# Altium project PCB_F2838_Node.PrjPcb (part 4 of 5)

## Sheet [6] ETHERCAT.SchDoc
size 431 x 279 mm; DocumentNumber: 7; SheetNumber: 7; SheetTotal: 9
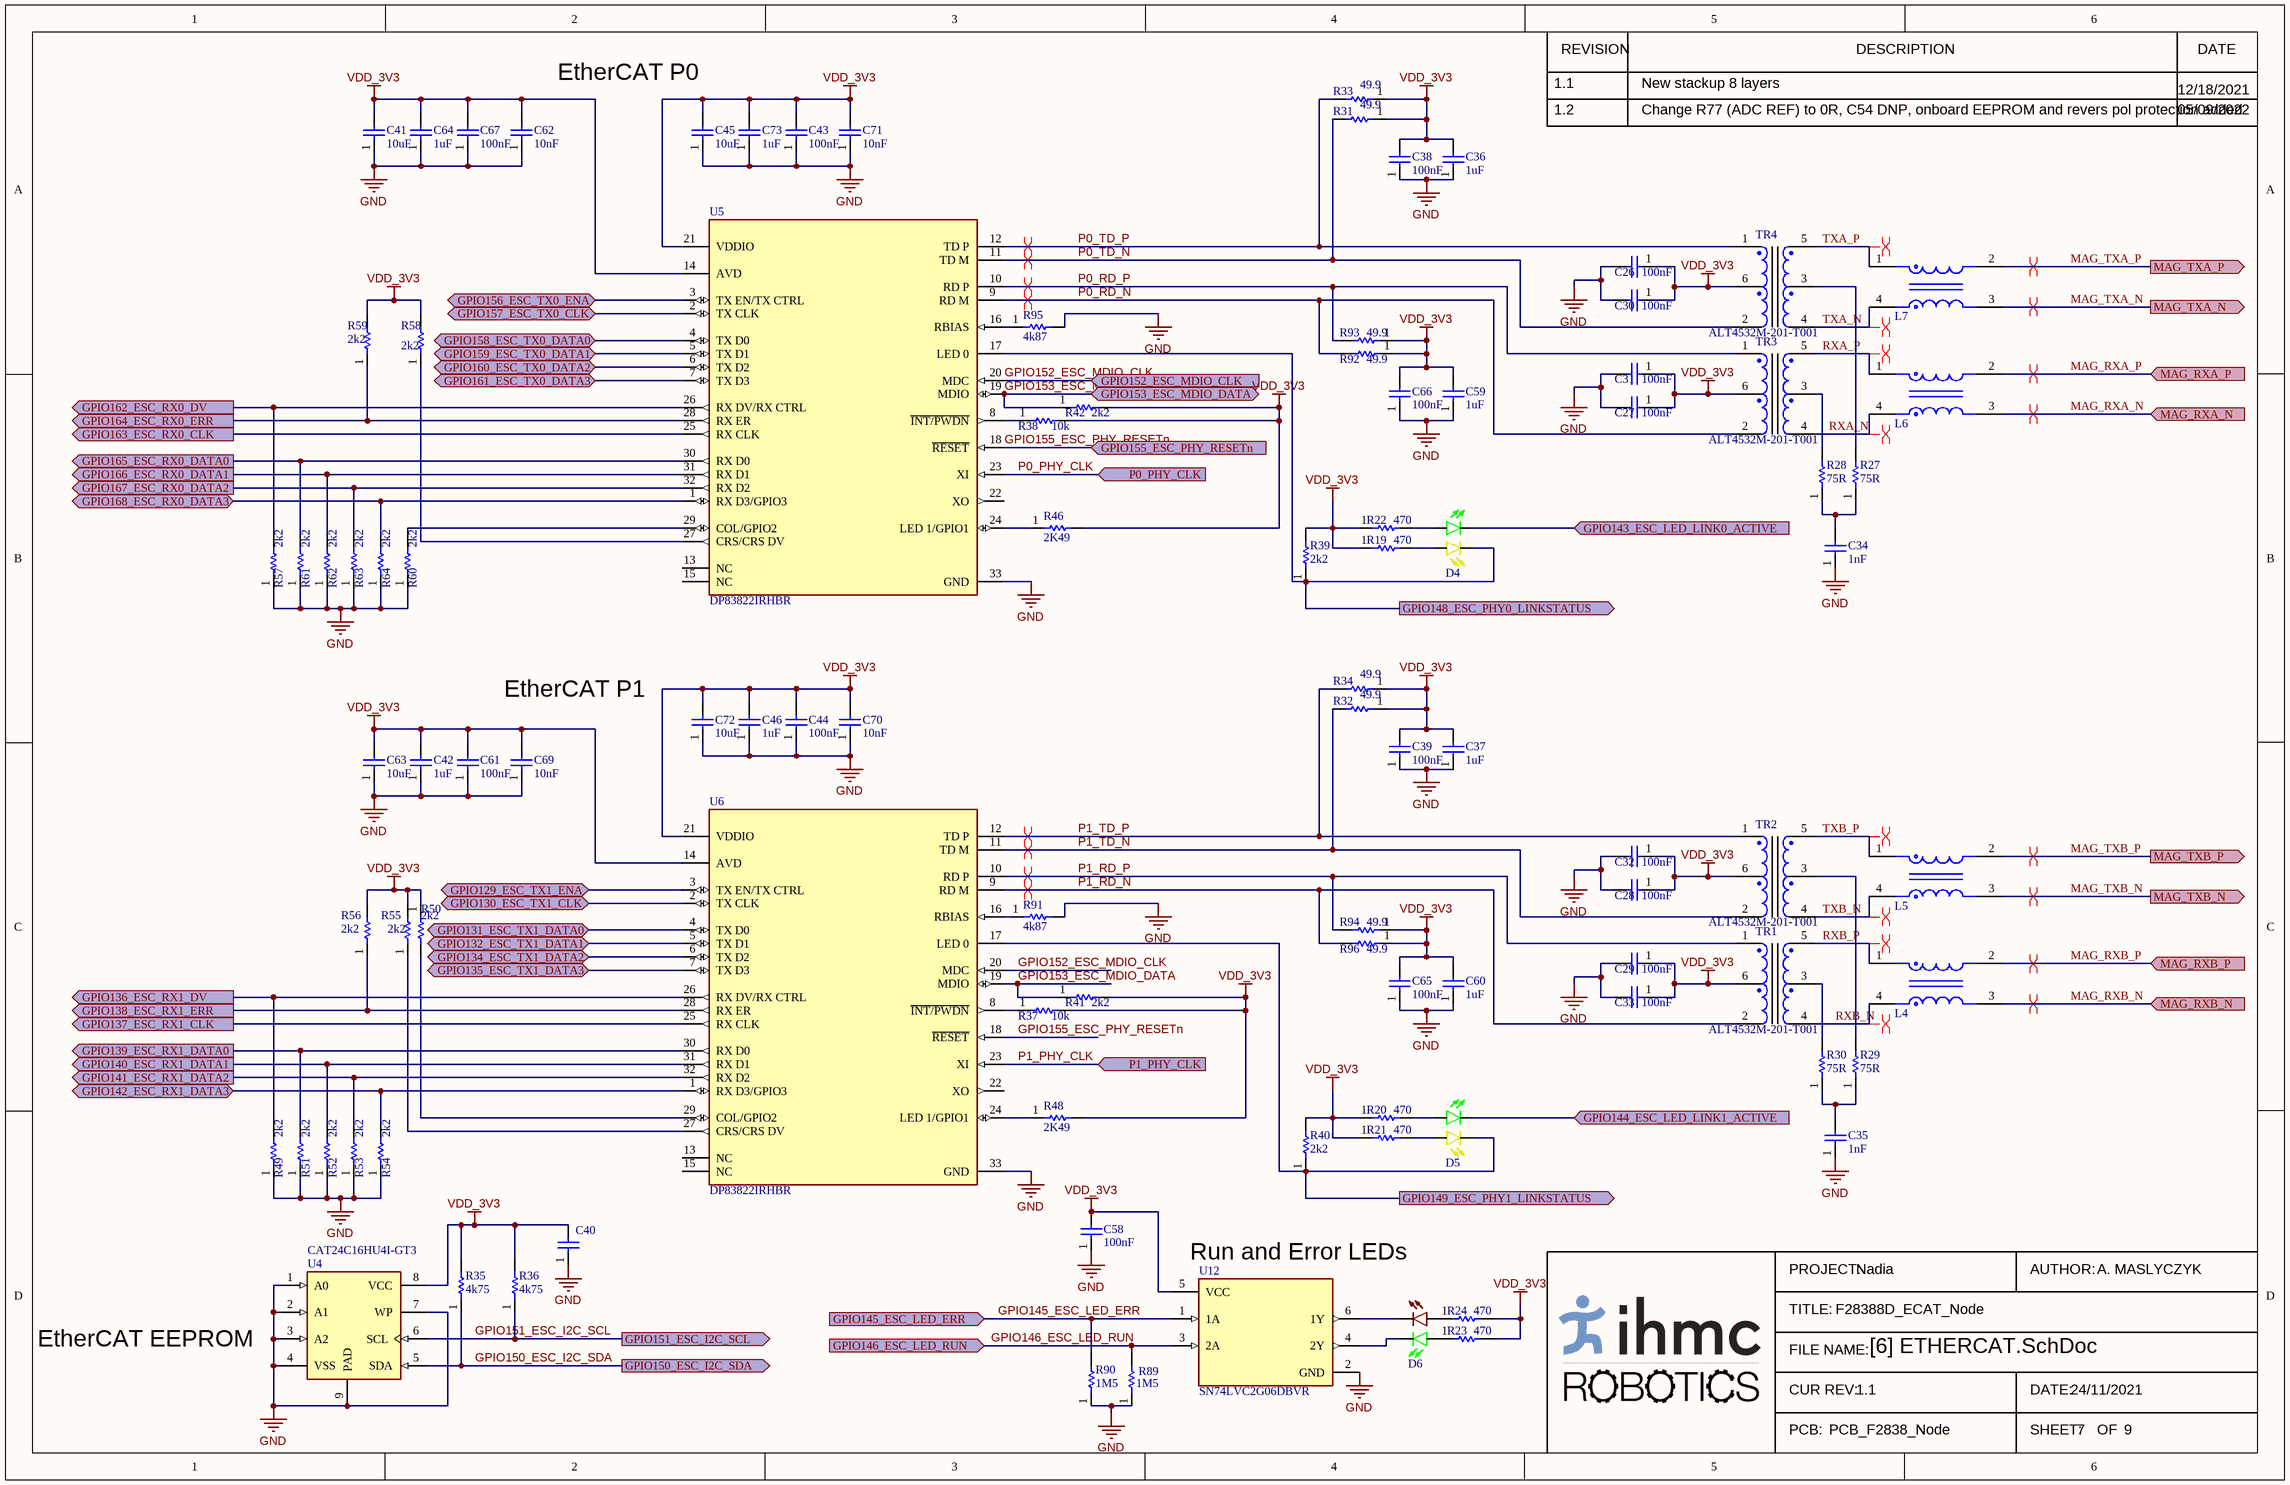
[diagram p6: [6] ETHERCAT.SchDoc]

### Parts
C26  value 100nF  [CAPC1005X03N(0402)]  (hidden comment: GRM155R71C104JA88D)
C27  value 100nF  [CAPC1005X03N(0402)]  (hidden comment: GRM155R71C104JA88D)
C28  value 100nF  [CAPC1005X03N(0402)]  (hidden comment: GRM155R71C104JA88D)
C29  value 100nF  [CAPC1005X03N(0402)]  (hidden comment: GRM155R71C104JA88D)
C30  value 100nF  [CAPC1005X03N(0402)]  (hidden comment: GRM155R71C104JA88D)
C31  value 100nF  [CAPC1005X03N(0402)]  (hidden comment: GRM155R71C104JA88D)
C32  value 100nF  [CAPC1005X03N(0402)]  (hidden comment: GRM155R71C104JA88D)
C33  value 100nF  [CAPC1005X03N(0402)]  (hidden comment: GRM155R71C104JA88D)
C34  value 1nF  [0402_C]  (hidden comment: C1005NP01H102J050BA)
C35  value 1nF  [0402_C]  (hidden comment: C1005NP01H102J050BA)
C36  value 1uF  [CAPC1608X09N(0603)]  (hidden comment: C0603C105K3PACTU)
C37  value 1uF  [CAPC1608X09N(0603)]  (hidden comment: C0603C105K3PACTU)
C38  value 100nF  [CAPC1005X03N(0402)]  (hidden comment: GRM155R71C104JA88D)
C39  value 100nF  [CAPC1005X03N(0402)]  (hidden comment: GRM155R71C104JA88D)
C40  GRM155R71C104JA88D  [CAPC1005X03N(0402)]  (value not drawn)
C41  value 10uF  [CAPC1608X09N(0603)]  (hidden comment: CL10X106MO8NRNC)
C42  value 1uF  [CAPC1608X09N(0603)]  (hidden comment: C0603C105K3PACTU)
C43  value 100nF  [CAPC1005X03N(0402)]  (hidden comment: GRM155R71C104JA88D)
C44  value 100nF  [CAPC1005X03N(0402)]  (hidden comment: GRM155R71C104JA88D)
C45  value 10uF  [CAPC1608X09N(0603)]  (hidden comment: CL10X106MO8NRNC)
C46  value 1uF  [CAPC1608X09N(0603)]  (hidden comment: C0603C105K3PACTU)
C58  value 100nF  [CAPC1005X03N(0402)]  (hidden comment: GRM155R71C104JA88D)
C59  value 1uF  [CAPC1608X09N(0603)]  (hidden comment: C0603C105K3PACTU)
C60  value 1uF  [CAPC1608X09N(0603)]  (hidden comment: C0603C105K3PACTU)
C61  value 100nF  [CAPC1005X03N(0402)]  (hidden comment: GRM155R71C104JA88D)
C62  value 10nF  [CAPC1005X03N(0402)]  (hidden comment: CC0402KRX7R9BB103)
C63  value 10uF  [CAPC1608X09N(0603)]  (hidden comment: CL10X106MO8NRNC)
C64  value 1uF  [CAPC1608X09N(0603)]  (hidden comment: C0603C105K3PACTU)
C65  value 100nF  [CAPC1005X03N(0402)]  (hidden comment: GRM155R71C104JA88D)
C66  value 100nF  [CAPC1005X03N(0402)]  (hidden comment: GRM155R71C104JA88D)
C67  value 100nF  [CAPC1005X03N(0402)]  (hidden comment: GRM155R71C104JA88D)
C69  value 10nF  [CAPC1005X03N(0402)]  (hidden comment: CC0402KRX7R9BB103)
C70  value 10nF  [CAPC1005X03N(0402)]  (hidden comment: CC0402KRX7R9BB103)
C71  value 10nF  [CAPC1005X03N(0402)]  (hidden comment: CC0402KRX7R9BB103)
C72  value 10uF  [CAPC1608X09N(0603)]  (hidden comment: CL10X106MO8NRNC)
C73  value 1uF  [CAPC1608X09N(0603)]  (hidden comment: C0603C105K3PACTU)
D4  LTST-C195KGJSKT  [Dual_LED]  (value not drawn)
D5  LTST-C195KGJSKT  [Dual_LED]  (value not drawn)
D6  LTST-C195KGJRKT  [Dual_LED]  (value not drawn)
L4  DLW21HN900SQ2L  [FP-DLW21HN-MFG]  (value not drawn)
L5  DLW21HN900SQ2L  [FP-DLW21HN-MFG]  (value not drawn)
L6  DLW21HN900SQ2L  [FP-DLW21HN-MFG]  (value not drawn)
L7  DLW21HN900SQ2L  [FP-DLW21HN-MFG]  (value not drawn)
R19  value 470  [0402]  (hidden comment: CRCW0402470RJNED)
R20  value 470  [0402]  (hidden comment: CRCW0402470RJNED)
R21  value 470  [0402]  (hidden comment: CRCW0402470RJNED)
R22  value 470  [0402]  (hidden comment: CRCW0402470RJNED)
R23  value 470  [0402]  (hidden comment: CRCW0402470RJNED)
R24  value 470  [0402]  (hidden comment: CRCW0402470RJNED)
R27  value 75R  [RESC1005X06N(0402)]  (hidden comment: CRCW040275R0FKEDC)
R28  value 75R  [RESC1005X06N(0402)]  (hidden comment: CRCW040275R0FKEDC)
R29  value 75R  [RESC1005X06N(0402)]  (hidden comment: CRCW040275R0FKEDC)
R30  value 75R  [RESC1005X06N(0402)]  (hidden comment: CRCW040275R0FKEDC)
R31  value 49.9  [RESC1005X06N(0402)]  (hidden comment: CRCW040249R9FKED)
R32  value 49.9  [RESC1005X06N(0402)]  (hidden comment: CRCW040249R9FKED)
R33  value 49.9  [RESC1005X06N(0402)]  (hidden comment: CRCW040249R9FKED)
R34  value 49.9  [RESC1005X06N(0402)]  (hidden comment: CRCW040249R9FKED)
R35  value 4k75  [RESC1005X06N(0402)]  (hidden comment: RC0402FR-074K75L)
R36  value 4k75  [RESC1005X06N(0402)]  (hidden comment: RC0402FR-074K75L)
R37  value 10k  [RESC1005X06N(0402)]  (hidden comment: RC0402FR-0710KL)
R38  value 10k  [RESC1005X06N(0402)]  (hidden comment: RC0402FR-0710KL)
R39  value 2k2  [0402]  (hidden comment: CRCW04022K20JNED)
R40  value 2k2  [0402]  (hidden comment: CRCW04022K20JNED)
R41  value 2k2  [0402]  (hidden comment: CRCW04022K20JNED)
R42  value 2k2  [0402]  (hidden comment: CRCW04022K20JNED)
R46  value 2K49  [0402]  (hidden comment: CRCW04022K49FKED)
R48  value 2K49  [0402]  (hidden comment: CRCW04022K49FKED)
R49  value 2k2  [0402]  (hidden comment: CRCW04022K20JNED)
R50  value 2k2  [0402]  (hidden comment: CRCW04022K20JNED)
R51  value 2k2  [0402]  (hidden comment: CRCW04022K20JNED)
R52  value 2k2  [0402]  (hidden comment: CRCW04022K20JNED)
R53  value 2k2  [0402]  (hidden comment: CRCW04022K20JNED)
R54  value 2k2  [0402]  (hidden comment: CRCW04022K20JNED)
R55  value 2k2  [0402]  (hidden comment: CRCW04022K20JNED)
R56  value 2k2  [0402]  (hidden comment: CRCW04022K20JNED)
R57  value 2k2  [0402]  (hidden comment: CRCW04022K20JNED)
R58  value 2k2  [0402]  (hidden comment: CRCW04022K20JNED)
R59  value 2k2  [0402]  (hidden comment: CRCW04022K20JNED)
R60  value 2k2  [0402]  (hidden comment: CRCW04022K20JNED)
R61  value 2k2  [0402]  (hidden comment: CRCW04022K20JNED)
R62  value 2k2  [0402]  (hidden comment: CRCW04022K20JNED)
R63  value 2k2  [0402]  (hidden comment: CRCW04022K20JNED)
R64  value 2k2  [0402]  (hidden comment: CRCW04022K20JNED)
R89  value 1M5  [0402]  (hidden comment: CRCW04021M50JNED)
R90  value 1M5  [0402]  (hidden comment: CRCW04021M50JNED)
R91  value 4k87  [0402]  (hidden comment: CRCW04024K87FKED)
R92  value 49.9  [RESC1005X06N(0402)]  (hidden comment: CRCW040249R9FKED)
R93  value 49.9  [RESC1005X06N(0402)]  (hidden comment: CRCW040249R9FKED)
R94  value 49.9  [RESC1005X06N(0402)]  (hidden comment: CRCW040249R9FKED)
R95  value 4k87  [0402]  (hidden comment: CRCW04024K87FKED)
R96  value 49.9  [RESC1005X06N(0402)]  (hidden comment: CRCW040249R9FKED)
TR1  ALT4532M-201-T001  [ALT4532M_LAN_Transformer]
TR2  ALT4532M-201-T001  [ALT4532M_LAN_Transformer]
TR3  ALT4532M-201-T001  [ALT4532M_LAN_Transformer]
TR4  ALT4532M-201-T001  [ALT4532M_LAN_Transformer]
U4  CAT24C16HU4I-GT3  [UDFN8-EP]
U5  DP83822IRHBR  [FP-RHB0032B-MFG]
U6  DP83822IRHBR  [FP-RHB0032B-MFG]
U12  SN74LVC2G06DBVR  [FP-DBV0006A-IPC_C]

### Ports
GPIO129_ESC_TX1_ENA (bidir), GPIO130_ESC_TX1_CLK (bidir), GPIO131_ESC_TX1_DATA0 (bidir), GPIO132_ESC_TX1_DATA1 (bidir), GPIO134_ESC_TX1_DATA2 (bidir), GPIO135_ESC_TX1_DATA3 (bidir), GPIO136_ESC_RX1_DV (out), GPIO137_ESC_RX1_CLK (out), GPIO138_ESC_RX1_ERR (out), GPIO139_ESC_RX1_DATA0 (out), GPIO140_ESC_RX1_DATA1 (out), GPIO141_ESC_RX1_DATA2 (out), GPIO142_ESC_RX1_DATA3 (bidir), GPIO143_ESC_LED_LINK0_ACTIVE (in), GPIO144_ESC_LED_LINK1_ACTIVE (in), GPIO145_ESC_LED_ERR (in), GPIO146_ESC_LED_RUN (in), GPIO148_ESC_PHY0_LINKSTATUS (out), GPIO149_ESC_PHY1_LINKSTATUS (out), GPIO150_ESC_I2C_SDA (out), GPIO151_ESC_I2C_SCL (out), GPIO152_ESC_MDIO_CLK (in), GPIO153_ESC_MDIO_DATA (bidir), GPIO155_ESC_PHY_RESETn (in), GPIO156_ESC_TX0_ENA (bidir), GPIO157_ESC_TX0_CLK (bidir), GPIO158_ESC_TX0_DATA0 (bidir), GPIO159_ESC_TX0_DATA1 (bidir), GPIO160_ESC_TX0_DATA2 (bidir), GPIO161_ESC_TX0_DATA3 (bidir), GPIO162_ESC_RX0_DV (out), GPIO163_ESC_RX0_CLK (out), GPIO164_ESC_RX0_ERR (out), GPIO165_ESC_RX0_DATA0 (out), GPIO166_ESC_RX0_DATA1 (out), GPIO167_ESC_RX0_DATA2 (out), GPIO168_ESC_RX0_DATA3 (bidir), MAG_RXA_N (in), MAG_RXA_P (in), MAG_RXB_N (in), MAG_RXB_P (in), MAG_TXA_N (out), MAG_TXA_P (out), MAG_TXB_N (out), MAG_TXB_P (out), P0_PHY_CLK (in), P1_PHY_CLK (in)

### Nets
GND: C26.2 C27.2 C28.2 C29.2 C30.2 C31.2 C32.2 C33.2 C34.1 C35.1 C36.1 C37.1 C38.1 C39.1 C40.1 C41.1 C42.1 C43.1 C44.1 C45.1 C46.1 C58.1 C59.1 C60.1 C61.1 C62.1 C63.1 C64.1 C65.1 C66.1 C67.1 C69.1 C70.1 C71.1 C72.1 C73.1 R49.1 R51.1 R52.1 R53.1 R54.1 R57.1 R60.1 R61.1 R62.1 R63.1 R64.1 R89.1 R90.1 R91.2 R95.2 U4.1(A0) U4.2(A1) U4.3(A2) U4.4(VSS) U4.7(WP) U4.9(PAD) U5.33(GND) U6.33(GND) U12.2(GND)
VDD_3V3: C26.1 C27.1 C28.1 C29.1 C30.1 C31.1 C32.1 C33.1 C36.2 C37.2 C38.2 C39.2 C40.2 C41.2 C42.2 C43.2 C44.2 C45.2 C46.2 C58.2 C59.2 C60.2 C61.2 C62.2 C63.2 C64.2 C65.2 C66.2 C67.2 C69.2 C70.2 C71.2 C72.2 C73.2 R19.1 R20.1 R21.1 R22.1 R23.2 R24.2 R31.1 R32.1 R33.1 R34.1 R35.2 R36.2 R37.2 R38.2 R39.2 R40.2 R41.2 R42.2 R46.2 R48.2 R50.1 R55.2 R56.2 R58.2 R59.2 R92.1 R93.1 R94.1 R96.1 TR1.6 TR2.6 TR3.6 TR4.6 U4.8(VCC) U5.14(AVD) U5.21(VDDIO) U6.14(AVD) U6.21(VDDIO) U12.5(VCC)
GPIO129_ESC_TX1_ENA: U6.3(TX_EN/TX_CTRL) ; port GPIO129_ESC_TX1_ENA
GPIO130_ESC_TX1_CLK: U6.2(TX_CLK) ; port GPIO130_ESC_TX1_CLK
GPIO131_ESC_TX1_DATA0: U6.4(TX_D0) ; port GPIO131_ESC_TX1_DATA0
GPIO132_ESC_TX1_DATA1: U6.5(TX_D1) ; port GPIO132_ESC_TX1_DATA1
GPIO134_ESC_TX1_DATA2: U6.6(TX_D2) ; port GPIO134_ESC_TX1_DATA2
GPIO135_ESC_TX1_DATA3: U6.7(TX_D3) ; port GPIO135_ESC_TX1_DATA3
GPIO136_ESC_RX1_DV: R49.2 U6.26(RX_DV/RX_CTRL) ; port GPIO136_ESC_RX1_DV
GPIO137_ESC_RX1_CLK: U6.25(RX_CLK) ; port GPIO137_ESC_RX1_CLK
GPIO138_ESC_RX1_ERR: R56.1 U6.28(RX_ER) ; port GPIO138_ESC_RX1_ERR
GPIO139_ESC_RX1_DATA0: R51.2 U6.30(RX_D0) ; port GPIO139_ESC_RX1_DATA0
GPIO140_ESC_RX1_DATA1: R52.2 U6.31(RX_D1) ; port GPIO140_ESC_RX1_DATA1
GPIO141_ESC_RX1_DATA2: R53.2 U6.32(RX_D2) ; port GPIO141_ESC_RX1_DATA2
GPIO142_ESC_RX1_DATA3: R54.2 U6.1(RX_D3/GPIO3) ; port GPIO142_ESC_RX1_DATA3
GPIO143_ESC_LED_LINK0_ACTIVE: D4.3 ; port GPIO143_ESC_LED_LINK0_ACTIVE
GPIO144_ESC_LED_LINK1_ACTIVE: D5.3 ; port GPIO144_ESC_LED_LINK1_ACTIVE
GPIO145_ESC_LED_ERR: R90.2 U12.1(1A) ; port GPIO145_ESC_LED_ERR
GPIO146_ESC_LED_RUN: R89.2 U12.3(2A) ; port GPIO146_ESC_LED_RUN
GPIO148_ESC_PHY0_LINKSTATUS: D4.4 R39.1 U5.17(LED_0) ; port GPIO148_ESC_PHY0_LINKSTATUS
GPIO149_ESC_PHY1_LINKSTATUS: D5.4 R40.1 U6.17(LED_0) ; port GPIO149_ESC_PHY1_LINKSTATUS
GPIO150_ESC_I2C_SDA: R35.1 U4.5(SDA) ; port GPIO150_ESC_I2C_SDA
GPIO151_ESC_I2C_SCL: R36.1 U4.6(SCL) ; port GPIO151_ESC_I2C_SCL
GPIO152_ESC_MDIO_CLK: U5.20(MDC) U6.20(MDC) ; port GPIO152_ESC_MDIO_CLK
GPIO153_ESC_MDIO_DATA: R41.1 R42.1 U5.19(MDIO) U6.19(MDIO) ; port GPIO153_ESC_MDIO_DATA
GPIO155_ESC_PHY_RESETn: U5.18(~{RESET}) U6.18(~{RESET}) ; port GPIO155_ESC_PHY_RESETn
GPIO156_ESC_TX0_ENA: U5.3(TX_EN/TX_CTRL) ; port GPIO156_ESC_TX0_ENA
GPIO157_ESC_TX0_CLK: U5.2(TX_CLK) ; port GPIO157_ESC_TX0_CLK
GPIO158_ESC_TX0_DATA0: U5.4(TX_D0) ; port GPIO158_ESC_TX0_DATA0
GPIO159_ESC_TX0_DATA1: U5.5(TX_D1) ; port GPIO159_ESC_TX0_DATA1
GPIO160_ESC_TX0_DATA2: U5.6(TX_D2) ; port GPIO160_ESC_TX0_DATA2
GPIO161_ESC_TX0_DATA3: U5.7(TX_D3) ; port GPIO161_ESC_TX0_DATA3
GPIO162_ESC_RX0_DV: R57.2 U5.26(RX_DV/RX_CTRL) ; port GPIO162_ESC_RX0_DV
GPIO163_ESC_RX0_CLK: U5.25(RX_CLK) ; port GPIO163_ESC_RX0_CLK
GPIO164_ESC_RX0_ERR: R59.1 U5.28(RX_ER) ; port GPIO164_ESC_RX0_ERR
GPIO165_ESC_RX0_DATA0: R61.2 U5.30(RX_D0) ; port GPIO165_ESC_RX0_DATA0
GPIO166_ESC_RX0_DATA1: R62.2 U5.31(RX_D1) ; port GPIO166_ESC_RX0_DATA1
GPIO167_ESC_RX0_DATA2: R63.2 U5.32(RX_D2) ; port GPIO167_ESC_RX0_DATA2
GPIO168_ESC_RX0_DATA3: R64.2 U5.1(RX_D3/GPIO3) ; port GPIO168_ESC_RX0_DATA3
MAG_RXA_N: L6.3 ; port MAG_RXA_N
MAG_RXA_P: L6.2 ; port MAG_RXA_P
MAG_RXB_N: L4.3 ; port MAG_RXB_N
MAG_RXB_P: L4.2 ; port MAG_RXB_P
MAG_TXA_N: L7.3 ; port MAG_TXA_N
MAG_TXA_P: L7.2 ; port MAG_TXA_P
MAG_TXB_N: L5.3 ; port MAG_TXB_N
MAG_TXB_P: L5.2 ; port MAG_TXB_P
P0_PHY_CLK: U5.23(XI) ; port P0_PHY_CLK
P0_RD_N: R92.2 TR3.2 U5.9(RD_M)
P0_RD_P: R93.2 TR3.1 U5.10(RD_P)
P0_TD_N: R31.2 TR4.2 U5.11(TD_M)
P0_TD_P: R33.2 TR4.1 U5.12(TD_P)
P1_PHY_CLK: U6.23(XI) ; port P1_PHY_CLK
P1_RD_N: R96.2 TR1.2 U6.9(RD_M)
P1_RD_P: R94.2 TR1.1 U6.10(RD_P)
P1_TD_N: R32.2 TR2.2 U6.11(TD_M)
P1_TD_P: R34.2 TR2.1 U6.12(TD_P)
RXA_N: L6.4 TR3.4
RXA_P: L6.1 TR3.5
RXB_N: L4.4 TR1.4
RXB_P: L4.1 TR1.5
TXA_N: L7.4 TR4.4
TXA_P: L7.1 TR4.5
TXB_N: L5.4 TR2.4
TXB_P: L5.1 TR2.5
NetC34_2: C34.2 R27.1 R28.1
NetC35_2: C35.2 R29.1 R30.1
NetD4_1: D4.1 R22.2
NetD4_2: D4.2 R19.2
NetD5_1: D5.1 R20.2
NetD5_2: D5.2 R21.2
NetD6_1: D6.1 R23.1
NetD6_2: D6.2 R24.1
NetD6_3: D6.3 U12.4(2Y)
NetD6_4: D6.4 U12.6(1Y)
NetR27_2: R27.2 TR4.3
NetR28_2: R28.2 TR3.3
NetR29_2: R29.2 TR2.3
NetR30_2: R30.2 TR1.3
NetR37_1: R37.1 U6.8(~{INT/PWDN})
NetR38_1: R38.1 U5.8(~{INT/PWDN})
NetR46_1: R46.1 U5.24(LED_1/GPIO1)
NetR48_1: R48.1 U6.24(LED_1/GPIO1)
NetR50_2: R50.2 U6.29(COL/GPIO2)
NetR55_1: R55.1 U6.27(CRS/CRS_DV)
NetR58_1: R58.1 U5.27(CRS/CRS_DV)
NetR60_2: R60.2 U5.29(COL/GPIO2)
NetR91_1: R91.1 U6.16(RBIAS)
NetR95_1: R95.1 U5.16(RBIAS)

Not connected (* = marked no-connect by the designer): U5 13(NC) 15(NC) 22(XO); U6 13(NC) 15(NC) 22(XO)

### Layout directives
differential pair: MAG_RXA_N, MAG_RXA_P, MAG_RXB_N, MAG_RXB_P, MAG_TXA_N, MAG_TXA_P, MAG_TXB_N, MAG_TXB_P, P0_RD_N, P0_RD_P, P0_TD_N, P0_TD_P, P1_RD_N, P1_RD_P, P1_TD_N, P1_TD_P, RXA_N, RXA_P, RXB_N, RXB_P, TXA_N, TXA_P, TXB_N, TXB_P

### Notes on the sheet
- EtherCAT P0
- EtherCAT P1
- (near U12) Run and Error LEDs
- EtherCAT EEPROM
- REVISION
- DESCRIPTION
- DATE
- PROJECT:
- AUTHOR:
- TITLE:
- FILE NAME:
- CUR REV:
- PCB:
- SHEET:
- DATE:
- OF

### Library data of the parts
C26-C33 C38 C39 C43 C44 C58 C61 C65-C67 = 100nF_16V_0402_CAP: CAP CER 0.1UF 16V X7R 0402; Tolerance: 5%; MPN: GRM155R71C104JA88D; Voltage Rating: 16V; Temp Coeff: X7R; Size/Package: 0402
C34 C35 = 1nF_50V_0402_C0G_CAP: CAP CER 1000PF 50V NP0 0402; Manufacturer: TDK; Tolerance: 5%; Dielectric: C0G; Voltage Rating: 50V; Supplier 1: Digi-Key; Manufacturer Part Number: C1005NP01H102J050BA; RoHS: Yes; Category: Ceramic Capacitors; Stock 1: 9; Pricing 1: 1=0.18000, 10=0.12800, 50=0.07240, 100=0.06000, 500=0.04208, 1000=0.03484, 2500=0.03243, 5000=0.02967 (USD); Mount: Surface Mount; Case/Package: 0402; Case Code (Metric): 1005; Case Code (Imperial): 0402; Weight: 2.3E-05oz; Min Operating Temperature: -55°C; Max Operating Temperature: 150°C; Package Quantity: 10000; Packaging: Tape and Reel; Capacitance: 1nF; Termination: SMD/SMT; Voltage Rating (DC): 50V; Features: High Temperature; Series: C; Length: 0.039inch; Width: 0.5mm; Height: 0.5mm; Thickness: 0.022inch; RoHS Compliant: Yes; ComponentLink1URL: http://www.mouser.com/ds/2/400/tdk_mlcc_commercial_general_en-542463.pdf?src-supplier=Mouser; ComponentLink1Description: http://www.mouser.com/ds/2/400/tdk_mlcc_commercial_general_en-542463.pdf?src-supplier=Mouser; ComponentLink2URL: https://product.tdk.com/info/en/documents/chara_sheet/C1005NP01H102J050BA.pdf?src-supplier=Digi-Key; ComponentLink2Description: https://product.tdk.com/info/en/documents/chara_sheet/C1005NP01H102J050BA.pdf?src-supplier=Digi-Key; ComponentLink3URL: http://product.tdk.com/en/catalog/datasheets/mlcc_commercial_hightemp_en.pdf?src-supplier=Avnet; ComponentLink3Description: http://product.tdk.com/en/catalog/datasheets/mlcc_commercial_hightemp_en.pdf?src-supplier=Avnet; Supplier Part Number 1: 445-13785-1-ND
C36 C37 C42 C46 C59 C60 C64 C73 = 1uF_25VDC_0603_Cap: MLCC - SMD/SMT 25volts 1uF X5R 10%; Voltage: 25VDC; Drawn By: TC; MPN: C0603C105K3PACTU; Tolerance: 10%; Supplier 1: Mouser; Supplier Part Number 1: 80-C0603C105K3PAC
C40 = 100nF_16V_0402_CAP: CAP CER 0.1UF 16V X7R 0402; Value: 100nF; Tolerance: 5%; MPN: GRM155R71C104JA88D; Voltage Rating: 16V; Temp Coeff: X7R; Size/Package: 0402
C41 C45 C63 C72 = 10uF_16V_0603_CAP: CAP CER 10UF 16V X6S 0603; Tolerance: 20%; MPN: CL10X106MO8NRNC; Voltage: 16V; Temp Coeff: X6S; Package/Case: 0603; Mounting Type: Surface Mount; Supplier 1: Digi-Key; Supplier Part Number 1: 1276-6769-1-ND
C62 C69-C71 = 10nF_50V_0402_CAP: CAP CER 10000PF 50V X7R 0402; Tolerance: 10%; MPN: CC0402KRX7R9BB103; Voltage: 50V; Temp Coeff: X7R; Size/Package: 0402; Supplier 1: Digi-Key; Supplier Part Number 1: 311-1349-1-ND
D4 D5 = Green/Yellow_LED: LED GREEN/YELLOW CLEAR CHIP SMD; Color: Green, Yellow; Voltage Vf: 2V Green, 2V Yellow; Current If: 20mA. 20mA; MPN: LTST-C195KGJSKT; Mounting Type: SMD
D6 = Green/Red_LED: LED GREEN/RED CLEAR CHIP SMD; Color: Green, Red; Voltage Vf: 2V Green, 2V Red; Current If: 20mA. 20mA; MPN: LTST-C195KGJRKT; Mounting Type: SMD; Supplier 1: Digi-Key; Supplier Part Number 1: 160-1452-1-ND
L4-L7 = CM_CHOKE_90O_DLW21HN900SQ2L: MURATA - DLW21HN900SQ2L - Filter, Common Mode, 90 ohm, 0.33 A, DLW21H Series, 2 mm x 1.2 mm x 0.9 mm; DC Current: 330mA; Tolerance: 25%; Frequency: 100MHz; Shielding: Unshielded; Impedance: 90R; Number of Lines: 2; DC Resistance (DCR): 350mR; Voltage Rating: 50V; Current Rating: 330mA; Lead Free: Lead Free; Length: 2mm; Radiation Hardening: No; Max Operating Temperature: 85°C; Depth: 1.2mm; Weight: 0.000317oz; Height: 0.9mm; Termination: SMD/SMT; Min Operating Temperature: -40°C; Case/Package: 0805; Packaging: Tape and Reel; Width: 0.047inch; Test Frequency: 100MHz; Mount: Surface Mount; Current: 330mA; Military Standard: Not; Package Quantity: 1; Resistor Type: Wirewound; Case Code (Imperial): 0805; Max DC Current: 330mA; Supplier 1: Digi-Key; Manufacturer: Murata; Manufacturer Part Number: DLW21HN900SQ2L; RoHS: Yes; Category: Inductors; Stock 1: 49290; Pricing 1: 1=0.49000, 10=0.42600, 25=0.39520, 50=0.33440, 100=0.30400, 250=0.28572, 500=0.25534, 1000=0.20670 (USD); Series: EMIFIL®, DLW21H; DC Resistance-Max: 350mR; RoHS Compliant: Yes; ComponentLink1URL: https://datasheet.ciiva.com/11800/0900766b80eb33c8-11800805.pdf?src-supplier=RSComponents; ComponentLink1Description: https://datasheet.ciiva.com/11800/0900766b80eb33c8-11800805.pdf?src-supplier=RSComponents; ComponentLink2URL: https://datasheet.ciiva.com/26793/dlw21hn900sq2l-26793329.pdf?src-supplier=IIIC; ComponentLink2Description: https://datasheet.ciiva.com/26793/dlw21hn900sq2l-26793329.pdf?src-supplier=IIIC; ComponentLink3URL: https://datasheet.ciiva.com/1007/l0114s0133dlw21h-1007611.pdf?src-supplier=Digi-Key; ComponentLink3Description: https://datasheet.ciiva.com/1007/l0114s0133dlw21h-1007611.pdf?src-supplier=Digi-Key; ComponentLink4URL: https://datasheet.ciiva.com/1007/l0114s0133dlw21h-1007612.pdf?src-supplier=Digi-Key; ComponentLink4Description: https://datasheet.ciiva.com/1007/l0114s0133dlw21h-1007612.pdf?src-supplier=Digi-Key; ComponentLink5URL: https://datasheet.ciiva.com/1007/l0114s0133dlw21h-1007613.pdf?src-supplier=Digi-Key; ComponentLink5Description: https://datasheet.ciiva.com/1007/l0114s0133dlw21h-1007613.pdf?src-supplier=Digi-Key; ComponentLink6URL: https://datasheet.ciiva.com/3081/l0114e-3081742.pdf?src-supplier=Avnet; ComponentLink6Description: https://datasheet.ciiva.com/3081/l0114e-3081742.pdf?src-supplier=Avnet; ComponentLink7URL: https://datasheet.ciiva.com/3081/l0114e-3081743.pdf?src-supplier=Avnet; ComponentLink7Description: https://datasheet.ciiva.com/3081/l0114e-3081743.pdf?src-supplier=Avnet; ComponentLink8URL: https://datasheet.ciiva.com/17277/l0114e-17277415.pdf?src-supplier=Avnet+Europe; ComponentLink8Description: https://datasheet.ciiva.com/17277/l0114e-17277415.pdf?src-supplier=Avnet+Europe; Supplier Part Number 1: 490-1064-1-ND
R19-R24 = 470_1/10W_0402_CRCW0402470RJNED: Vishay CRCW Series Thick Film Resistor 0402 Case 470 5% 0.063W 200ppm/K; Manufacturer: Vishay Dale; Resistance: 470R; Max Power Dissipation: 63mW; Temperature Coefficient: 200ppm/°C; Voltage Rating: 50V; Supplier 1: Digi-Key; Manufacturer Part Number: CRCW0402470RJNED; RoHS: Yes; Category: Chip SMD Resistors; Pricing 1: 1=0,10000, 10=0,03300, 100=0,01360, 1000=0,00610, 2500=0,00529, 5000=0,00437 (USD); Case/Package: 0402; Number of Pins: 2; Weight: 2.3E-05oz; Case Code (Metric): 1005; Case Code (Imperial): 0402; Contact Plating: Tin; Min Operating Temperature: -55°C; Max Operating Temperature: 155°C; Packaging: Tape and Reel; Tolerance: 5%; Package Quantity: 1; Resistor Type: Thick Film; Number of Terminations: 2; Features: Automotive AEC-Q200; Power Rating: 63mW; Termination: SMD/SMT; Series: CRCW; Voltage Rating (DC): 50V; Resistance Tolerance: 5%; Construction: Rectangular; Technology: THICK FILM; Length: 1mm; Width: 0.02inch; Height: 0.35mm; Depth: 0.5mm; Radiation Hardening: No; RoHS Compliant: Yes; Lead Free: Lead Free; Military Standard: Not; REACH SVHC: Unknown; ComponentLink1URL: https://datasheet.ciiva.com/2461/dcrcwe3-2461992.pdf?src-supplier=Digi-Key; ComponentLink1Description: https://datasheet.ciiva.com/2461/dcrcwe3-2461992.pdf?src-supplier=Digi-Key; ComponentLink2URL: https://datasheet.ciiva.com/2461/dcrcwe3-2461993.pdf?src-supplier=Digi-Key; ComponentLink2Description: https://datasheet.ciiva.com/2461/dcrcwe3-2461993.pdf?src-supplier=Digi-Key; ComponentLink3URL: https://datasheet.ciiva.com/2461/dcrcwe3-2461994.pdf?src-supplier=Digi-Key; ComponentLink3Description: https://datasheet.ciiva.com/2461/dcrcwe3-2461994.pdf?src-supplier=Digi-Key; ComponentLink4URL: https://datasheet.ciiva.com/5550/dcrcwe3-109170-5550440.pdf?src-supplier=Mouser; ComponentLink4Description: https://datasheet.ciiva.com/5550/dcrcwe3-109170-5550440.pdf?src-supplier=Mouser; ComponentLink5URL: https://datasheet.ciiva.com/3256/dcrcwe3-3256554.pdf?src-supplier=Avnet; ComponentLink5Description: https://datasheet.ciiva.com/3256/dcrcwe3-3256554.pdf?src-supplier=Avnet; ComponentLink6URL: https://datasheet.ciiva.com/8336/dcrcwe3-8336717.pdf?src-supplier=Avnet; ComponentLink6Description: https://datasheet.ciiva.com/8336/dcrcwe3-8336717.pdf?src-supplier=Avnet; ComponentLink7URL: https://datasheet.ciiva.com/28571/1847332-28571880.pdf?src-supplier=Element14; ComponentLink7Description: https://datasheet.ciiva.com/28571/1847332-28571880.pdf?src-supplier=Element14; Supplier Part Number 1: 541-470JDKR-ND
R27-R30 = 75R_1/10W_0402_RES: RES SMD 75 OHM 1% 1/16W 0402; Tolerance: +/-1%; MPN: CRCW040275R0FKEDC; Wattage: 1/16W; Drawn By: TC; Size/Package: 0402
R31-R34 R92-R94 R96 = 49R9_1/10W_0402_RES: RES SMD 49.9 OHM 1% 1/16W 0402; MPN: CRCW040249R9FKED; Wattage: 1/16W; Drawn By: TC; Tolerance: 1%; Supplier 1: Digi-Key; Supplier Part Number 1: 541-49.9LCT-ND
R35 R36 = 4k75_1/16_0402_RES: RES SMD 4.75K OHM 1% 1/16W 0402; Power: 1/16; MPN: RC0402FR-074K75L; Tolerance: 1%; Package/Case: 0402
R37 R38 = 10k_1/16W_0402_RES: RES SMD 10K OHM 1% 1/16W 0402; Tolerance: 1%; Power: 1/16W; Size: 0402; MPN: RC0402FR-0710KL
R39-R42 R49-R64 = 2k2_1/16_0402_CRCW04022K20JNED_RES: Vishay CRCW Series Thick Film Resistor 0402 Case 2.2k 5% 0.063W 200ppm/K; Manufacturer: Vishay Dale; Resistance: 2.2kR; Temperature Coefficient: 200ppm/°C; Max Power Dissipation: 63mW; Voltage Rating: 50V; Supplier 1: Digi-Key; Manufacturer Part Number: CRCW04022K20JNED; RoHS: Yes; Category: Chip SMD Resistors; Stock 1: 5003; Pricing 1: 1=0,10000, 10=0,03300, 100=0,01360, 1000=0,00610, 2500=0,00529, 5000=0,00437 (USD); Mount: Surface Mount; Case/Package: 0402; Case Code (Imperial): 0402; Case Code (Metric): 1005; Contact Plating: Tin; Weight: 2.3E-05oz; Size Code: 0402; Min Operating Temperature: -55°C; Max Operating Temperature: 155°C; Tolerance: 5%; Resistor Type: Thick Film; Packaging: Tape and Reel; Number of Terminations: 2; Power Rating: 63mW; Package Quantity: 1; Features: Automotive AEC-Q200; Termination: SMD/SMT; Voltage Rating (DC): 50V; Series: CRCW; Resistance Tolerance: 5%; Construction: Rectangular; Technology: THICK FILM; Length: 1mm; Width: 0.5mm; Height: 0.35mm; Depth: 0.5mm; Radiation Hardening: No; RoHS Compliant: Yes; Lead Free: Lead Free; REACH SVHC: Unknown; Military Standard: Not; ComponentLink1URL: https://datasheet.ciiva.com/5542/dcrcwe3-109170-5542006.pdf?src-supplier=Mouser; ComponentLink1Description: https://datasheet.ciiva.com/5542/dcrcwe3-109170-5542006.pdf?src-supplier=Mouser; ComponentLink2URL: https://datasheet.ciiva.com/3256/dcrcwe3-3256342.pdf?src-supplier=Avnet; ComponentLink2Description: https://datasheet.ciiva.com/3256/dcrcwe3-3256342.pdf?src-supplier=Avnet; ComponentLink3URL: https://datasheet.ciiva.com/3256/dcrcwe3-3256343.pdf?src-supplier=Avnet; ComponentLink3Description: https://datasheet.ciiva.com/3256/dcrcwe3-3256343.pdf?src-supplier=Avnet; ComponentLink4URL: https://datasheet.ciiva.com/2462/dcrcwe3-2462040.pdf?src-supplier=Digi-Key; ComponentLink4Description: https://datasheet.ciiva.com/2462/dcrcwe3-2462040.pdf?src-supplier=Digi-Key; ComponentLink5URL: https://datasheet.ciiva.com/2462/dcrcwe3-2462041.pdf?src-supplier=Digi-Key; ComponentLink5Description: https://datasheet.ciiva.com/2462/dcrcwe3-2462041.pdf?src-supplier=Digi-Key; ComponentLink6URL: https://datasheet.ciiva.com/2462/dcrcwe3-2462042.pdf?src-supplier=Digi-Key; ComponentLink6Description: https://datasheet.ciiva.com/2462/dcrcwe3-2462042.pdf?src-supplier=Digi-Key; ComponentLink7URL: https://datasheet.ciiva.com/16760/70201119-16760139.pdf?src-supplier=Allied+Electronics; ComponentLink7Description: https://datasheet.ciiva.com/16760/70201119-16760139.pdf?src-supplier=Allied+Electronics; ComponentLink8URL: https://datasheet.ciiva.com/16436/dcrcwe3-16436154.pdf?src-supplier=Future+Electronics; ComponentLink8Description: https://datasheet.ciiva.com/16436/dcrcwe3-16436154.pdf?src-supplier=Future+Electronics; ComponentLink9URL: https://datasheet.ciiva.com/7743/dcrcwe3-7743566.pdf?src-supplier=Element14; ComponentLink9Description: https://datasheet.ciiva.com/7743/dcrcwe3-7743566.pdf?src-supplier=Element14; Supplier Part Number 1: 541-2.2KJCT-ND
R46 R48 = 2K49_1/16W_0402_CRCW04022K49FKED_RES: VISHAY - CRCW04022K49FKED - Chipwiderstand, Oberflächenmontage, Dickschicht, 0402 [Metrisch 1005], 2.49 kohm, Baureihe CRCW; Resistance: 2.49kR; Tolerance: 1%; Temperature Coefficient: 100ppm/°C; Max Power Dissipation: 63mW; Voltage Rating: 50V; Supplier 1: Digi-Key; Manufacturer: Vishay; Manufacturer Part Number: CRCW04022K49FKED; RoHS: Yes; Category: Chip SMD Resistors; Pricing 1: 1=0,10000, 10=0,03800, 100=0,01530, 1000=0,00686, 2500=0,00595, 5000=0,00492 (USD); Mount: Surface Mount; Case/Package: 0402; Contact Plating: Tin; Weight: 2.3E-05oz; Case Code (Imperial): 0402; Case Code (Metric): 1005; Min Operating Temperature: -55°C; Max Operating Temperature: 155°C; Resistor Type: Thick Film; Packaging: Tape and Reel; Package Quantity: 10; Number of Terminations: 2; Features: Automotive AEC-Q200; Series: CRCW; Power Rating: 63mW; Termination: SMD/SMT; Voltage Rating (DC): 50V; Working Voltage: 50V; Resistance Tolerance: 1%; Technology: THICK FILM; Construction: Rectangular; Length: 1mm; Width: 0.5mm; Height: 0.35mm; Depth: 0.5mm; Radiation Hardening: No; Lead Free: Lead Free; RoHS Compliant: Yes; REACH SVHC: Unknown; Military Standard: Not; ComponentLink1URL: https://datasheet.ciiva.com/11809/0900766b80d98824-11809149.pdf?src-supplier=RSComponents; ComponentLink1Description: https://datasheet.ciiva.com/11809/0900766b80d98824-11809149.pdf?src-supplier=RSComponents; ComponentLink2URL: https://datasheet.ciiva.com/2463/dcrcwe3-2463193.pdf?src-supplier=Digi-Key; ComponentLink2Description: https://datasheet.ciiva.com/2463/dcrcwe3-2463193.pdf?src-supplier=Digi-Key; ComponentLink3URL: https://datasheet.ciiva.com/2463/dcrcwe3-2463194.pdf?src-supplier=Digi-Key; ComponentLink3Description: https://datasheet.ciiva.com/2463/dcrcwe3-2463194.pdf?src-supplier=Digi-Key; ComponentLink4URL: https://datasheet.ciiva.com/2463/dcrcwe3-2463195.pdf?src-supplier=Digi-Key; ComponentLink4Description: https://datasheet.ciiva.com/2463/dcrcwe3-2463195.pdf?src-supplier=Digi-Key; ComponentLink5URL: https://datasheet.ciiva.com/3256/dcrcwe3-3256350.pdf?src-supplier=Avnet; ComponentLink5Description: https://datasheet.ciiva.com/3256/dcrcwe3-3256350.pdf?src-supplier=Avnet; ComponentLink6URL: https://datasheet.ciiva.com/3256/dcrcwe3-3256351.pdf?src-supplier=Avnet; ComponentLink6Description: https://datasheet.ciiva.com/3256/dcrcwe3-3256351.pdf?src-supplier=Avnet; ComponentLink7URL: https://datasheet.ciiva.com/5562/dcrcwe3-109170-5562280.pdf?src-supplier=Mouser; ComponentLink7Description: https://datasheet.ciiva.com/5562/dcrcwe3-109170-5562280.pdf?src-supplier=Mouser; ComponentLink8URL: https://datasheet.ciiva.com/16202/dcrcwe3-16202631.pdf?src-supplier=Future+Electronics; ComponentLink8Description: https://datasheet.ciiva.com/16202/dcrcwe3-16202631.pdf?src-supplier=Future+Electronics; ComponentLink9URL: https://datasheet.ciiva.com/16767/70201119-16767751.pdf?src-supplier=Allied+Electronics; ComponentLink9Description: https://datasheet.ciiva.com/16767/70201119-16767751.pdf?src-supplier=Allied+Electronics; ComponentLink10URL: https://datasheet.ciiva.com/16775/70201119-16775110.pdf?src-supplier=Allied+Electronics; ComponentLink10Description: https://datasheet.ciiva.com/16775/70201119-16775110.pdf?src-supplier=Allied+Electronics; Supplier Part Number 1: 541-2.49KLDKR-ND
R89 R90 = 1M5_1/16W_0402_CRCW04021M50JNED_RES: RES SMD 1.5M OHM 5% 1/16W 0402; Manufacturer: Vishay Dale; Resistance: 1.5MR; Power Rating: 63mW; Voltage Rating: 50V; Temperature Coefficient: 200ppm/°C; Supplier 1: Digi-Key; Manufacturer Part Number: CRCW04021M50JNED; RoHS: Yes; Category: Chip SMD Resistors; Stock 1: 7870; Pricing 1: 1=0,10000, 10=0,03300, 100=0,01360, 1000=0,00610, 2500=0,00529, 5000=0,00437 (USD); Case/Package: 0402; Weight: 2.3E-05oz; Case Code (Imperial): 0402; Case Code (Metric): 1005; Contact Plating: Tin; Min Operating Temperature: -55°C; Max Operating Temperature: 155°C; Tolerance: 5%; Package Quantity: 1; Packaging: Tape and Reel; Termination: SMD/SMT; Resistor Type: Thick Film; Number of Terminations: 2; Max Power Dissipation: 63mW; Voltage Rating (DC): 50V; Features: Automotive AEC-Q200; Series: CRCW; Construction: Rectangular; Length: 1mm; Width: 0.5mm; Height: 0.016inch; Depth: 0.5mm; Radiation Hardening: No; RoHS Compliant: Yes; Military Standard: Not; Lead Free: Lead Free; ComponentLink1URL: https://datasheet.ciiva.com/9100/dcrcwe3-9100251.pdf?src-supplier=Avnet; ComponentLink1Description: https://datasheet.ciiva.com/9100/dcrcwe3-9100251.pdf?src-supplier=Avnet; ComponentLink2URL: https://datasheet.ciiva.com/2493/dcrcwe3-2493529.pdf?src-supplier=Digi-Key; ComponentLink2Description: https://datasheet.ciiva.com/2493/dcrcwe3-2493529.pdf?src-supplier=Digi-Key; ComponentLink3URL: https://datasheet.ciiva.com/2493/dcrcwe3-2493530.pdf?src-supplier=Digi-Key; ComponentLink3Description: https://datasheet.ciiva.com/2493/dcrcwe3-2493530.pdf?src-supplier=Digi-Key; ComponentLink4URL: https://datasheet.ciiva.com/2493/dcrcwe3-2493531.pdf?src-supplier=Digi-Key; ComponentLink4Description: https://datasheet.ciiva.com/2493/dcrcwe3-2493531.pdf?src-supplier=Digi-Key; Supplier Part Number 1: 541-1.5MJCT-ND
R91 R95 = 4K87_0402_1/16W_CRCW04024K87FKED_RES: Res Thick Film 0402 4.87K Ohm 1% 1/16W 100ppm/C Molded SMD SMD Paper T/R; Manufacturer: Vishay; Resistance: 4.87kR; Temperature Coefficient: 100ppm/°C; Power Rating: 63mW; Voltage Rating: 50V; Supplier 1: Digi-Key; Manufacturer Part Number: CRCW04024K87FKED; RoHS: Yes; Category: Chip SMD Resistors; Stock 1: 14733; Pricing 1: 1=0,10000, 10=0,03800, 100=0,01530, 1000=0,00686, 2500=0,00595, 5000=0,00492 (USD); Mount: Surface Mount; Case/Package: 0402; Number of Pins: 2; Contact Plating: Tin; Weight: 2.3E-05oz; Case Code (Imperial): 0402; Case Code (Metric): 1005; Size Code: 0402; Min Operating Temperature: -55°C; Max Operating Temperature: 155°C; Tolerance: 1%; Packaging: Tape and Reel; Resistor Type: Thick Film; Package Quantity: 10; Termination: SMD/SMT; Number of Terminations: 2; Max Power Dissipation: 63mW; Features: Automotive AEC-Q200; Series: CRCW; Voltage Rating (DC): 50V; Technology: THICK FILM; Construction: Rectangular; Resistance Tolerance: 1%; Length: 1mm; Width: 0.5mm; Height: 0.35mm; Depth: 0.5mm; Radiation Hardening: No; Lead Free: Lead Free; RoHS Compliant: Yes; REACH SVHC: Unknown; Military Standard: Not; ComponentLink1URL: https://datasheet.ciiva.com/11818/0900766b80d98824-11818081.pdf?src-supplier=RSComponents; ComponentLink1Description: https://datasheet.ciiva.com/11818/0900766b80d98824-11818081.pdf?src-supplier=RSComponents; ComponentLink2URL: https://datasheet.ciiva.com/2495/dcrcwe3-2495452.pdf?src-supplier=Digi-Key; ComponentLink2Description: https://datasheet.ciiva.com/2495/dcrcwe3-2495452.pdf?src-supplier=Digi-Key; ComponentLink3URL: https://datasheet.ciiva.com/2495/dcrcwe3-2495453.pdf?src-supplier=Digi-Key; ComponentLink3Description: https://datasheet.ciiva.com/2495/dcrcwe3-2495453.pdf?src-supplier=Digi-Key; ComponentLink4URL: https://datasheet.ciiva.com/2495/dcrcwe3-2495454.pdf?src-supplier=Digi-Key; ComponentLink4Description: https://datasheet.ciiva.com/2495/dcrcwe3-2495454.pdf?src-supplier=Digi-Key; ComponentLink5URL: https://datasheet.ciiva.com/5551/dcrcwe3-109170-5551690.pdf?src-supplier=Mouser; ComponentLink5Description: https://datasheet.ciiva.com/5551/dcrcwe3-109170-5551690.pdf?src-supplier=Mouser; ComponentLink6URL: https://datasheet.ciiva.com/3256/dcrcwe3-3256603.pdf?src-supplier=Avnet; ComponentLink6Description: https://datasheet.ciiva.com/3256/dcrcwe3-3256603.pdf?src-supplier=Avnet; ComponentLink7URL: https://datasheet.ciiva.com/7679/1697337-7679067.pdf?src-supplier=Element14; ComponentLink7Description: https://datasheet.ciiva.com/7679/1697337-7679067.pdf?src-supplier=Element14; ComponentLink8URL: https://datasheet.ciiva.com/7679/1697337-7679257.pdf?src-supplier=Element14; ComponentLink8Description: https://datasheet.ciiva.com/7679/1697337-7679257.pdf?src-supplier=Element14; ComponentLink9URL: https://datasheet.ciiva.com/16395/dcrcwe3-16395451.pdf?src-supplier=Future+Electronics; ComponentLink9Description: https://datasheet.ciiva.com/16395/dcrcwe3-16395451.pdf?src-supplier=Future+Electronics; Supplier Part Number 1: 541-4.87KLCT-ND
TR1-TR4 = Pulse_Transfo_LAN_ALT4532M-201-T001: Telecom Transformer 1CT:1CT 6 Terminal SMD; Manufacturer: TDK; Turns Ratio: 1:1; Inductance: 200uH; Insertion Loss: 1.5dB; Shielding: Shielded; Max DC Current: 8mA; Supplier 1: Digi-Key; Manufacturer Part Number: ALT4532M-201-T001; RoHS: No; Category: Transformers; Stock 1: 113; Pricing 1: 1=1.50000, 10=1.20000, 25=0.97520, 50=0.95000, 100=0.92500, 250=0.90000, 500=0.89250, 1000=0.79000 (USD); Mount: Surface Mount; Min Operating Temperature: -40°C; Max Operating Temperature: 85°C; Package Quantity: 2000; Packaging: Tape and Reel; Termination: SMD/SMT; Length: 4.5mm; Width: 3.2mm; Height: 2.8mm; Height - Seated (Max): 2.9mm; Depth: 2.9mm; REACH SVHC: No SVHC; Lead Free: Lead Free; ComponentLink1URL: https://datasheet.ciiva.com/46404/1809772-46404344.pdf?src-supplier=Element14; ComponentLink1Description: https://datasheet.ciiva.com/46404/1809772-46404344.pdf?src-supplier=Element14; ComponentLink2URL: https://datasheet.ciiva.com/46404/1809772-46404345.pdf?src-supplier=Element14; ComponentLink2Description: https://datasheet.ciiva.com/46404/1809772-46404345.pdf?src-supplier=Element14; ComponentLink3URL: https://datasheet.ciiva.com/18456/trans-alt-en-18456972.pdf?src-supplier=Digi-Key; ComponentLink3Description: https://datasheet.ciiva.com/18456/trans-alt-en-18456972.pdf?src-supplier=Digi-Key; ComponentLink4URL: https://datasheet.ciiva.com/18456/trans-alt-en-18456971.pdf?src-supplier=Digi-Key; ComponentLink4Description: https://datasheet.ciiva.com/18456/trans-alt-en-18456971.pdf?src-supplier=Digi-Key; ComponentLink5URL: https://datasheet.ciiva.com/18456/trans-alt-en-18456973.pdf?src-supplier=Digi-Key; ComponentLink5Description: https://datasheet.ciiva.com/18456/trans-alt-en-18456973.pdf?src-supplier=Digi-Key; Supplier Part Number 1: 445-15085-1-ND
U4 = CAT24C16HU4I-GT3_EEPROM_16Kb: EEPROM Serial-2Wire 16K-bit 2K x 8 1.8V/2.5V/3.3V/5V Automotive 8-Pin UDFN EP T/R; Manufacturer: ON Semiconductor; Interface: I2C,Serial,2-Wire; Frequency: 100kHz; Min Supply Voltage: 1.7V; Max Supply Voltage: 5.5V; Access Time: 900ns; Nominal Supply Current: 2mA; Density: 16Kb; Number of Words: 2000; Max Frequency: 400kHz; Organization: 2KX8; Write Protection: YES; Supplier 1: Digi-Key; Manufacturer Part Number: CAT24C16HU4I-GT3; RoHS: Yes; Category: EEPROM; Stock 1: 2625; Pricing 1: 1=0.41000, 10=0.40300, 25=0.37440, 50=0.37240, 100=0.33080, 250=0.32656, 500=0.32164, 1000=0.31304 (USD); Mount: Surface Mount; Number of Pins: 8; Contact Plating: Gold; Min Operating Temperature: -40°C; Max Operating Temperature: 85°C; Packaging: Tape and Reel; Memory Type: EEPROM; Package Quantity: 3000; Memory Size: 16Kb; Series: -; Access Time-Max: 900ns; Supply Current: 2mA; Length: 3.05mm; Width: 2.05mm; Height: 0.5mm; REACH SVHC: No SVHC; Lead Free: Lead Free; Halogen Free: Halogen Free; RoHS Compliant: Yes; ComponentLink1URL: https://datasheet.ciiva.com/22618/1696759-22618473.pdf?src-supplier=Element14; ComponentLink1Description: https://datasheet.ciiva.com/22618/1696759-22618473.pdf?src-supplier=Element14; Supplier Part Number 1: CAT24C16HU4I-GT3OSCT-ND
U5 U6 = PHY_ETHER_ DP83822IRHBR: IC TXRX ETHERNET 32VQFN; Manufacturer: Texas Instruments; Cable Length: 150m; Data Rate: 100Kbps; Max Operating Temperature: 85°C; Min Operating Temperature: -40°C; Packaging: Tape and Reel; Case/Package: VQFN; Lead Free: Lead Free; Mount: Surface Mount; RoHS Compliant: Yes; Supplier 1: Digi-Key; Manufacturer Part Number: DP83822IRHBR; RoHS: Yes; Category: Ethernet Interface ICs; Pricing 1: 1=3,00000, 10=2,69100, 25=2,53880, 100=2,16300, 250=2,03096, 500=1,77708, 1000=1,67650 (USD); ComponentLink1URL: http://www.ti.com/lit/ds/symlink/dp83822i.pdf?src-supplier=Digi-Key; ComponentLink1Description: http://www.ti.com/lit/ds/symlink/dp83822i.pdf?src-supplier=Digi-Key; ComponentLink2URL: http://www.ti.com/general/docs/suppproductinfo.tsp?distId=10&amp;gotoUrl=http%3A%2F%2Fwww.ti.com%2Flit%2Fgpn%2Fdp83822i&src-supplier=Digi-Key; ComponentLink2Description: http://www.ti.com/general/docs/suppproductinfo.tsp?distId=10&amp;gotoUrl=http%3A%2F%2Fwww.ti.com%2Flit%2Fgpn%2Fdp83822i&src-supplier=Digi-Key; Supplier Part Number 1: 296-47256-6-ND
U12 = BUF_dual_SN74LVC2G06DBVR: Buffer/Driver 2-CH Inverting Open Drain CMOS 6-Pin SOT-23 T/R; Manufacturer: Texas Instruments; Number of Channels: 2; Propagation Delay: 2.9ns; Min Supply Voltage: 1.65V; High Level Output Current: 32mA; Logic Function: Buffer; Max Supply Voltage: 5.5V; Nominal Supply Current: 40mA; Turn-On Delay Time: 7.2ns; Quiescent Current: 10uA; Number of Inputs: 1; Height: 1.15mm; Radiation Hardening: No; Length: 2.9mm; Number of Output Lines: 2; Package Quantity: 3000; Min Operating Temperature: -40°C; Case/Package: SOT-23; REACH SVHC: No SVHC; Number of Elements: 2; Number of Pins: 6; Mount: Surface Mount; Polarity: Inverting; Contact Plating: Gold; Number of Input Lines: 2; Number of Outputs: 2; Number of Circuits: 2; Number of Gates: 2; Max Operating Temperature: 125°C; RoHS Compliant: Yes; Low Level Output Current: 32mA; Number of Bits: 2; Width: 1.6mm; Packaging: Tape and Reel; Lead Free: Lead Free; Supplier 1: Digi-Key; Manufacturer Part Number: SN74LVC2G06DBVR; RoHS: Yes; Category: Logic Gates; Stock 1: 3468; Pricing 1: 1=0,47000, 10=0,35600, 25=0,32080, 100=0,22150, 250=0,18656, 500=0,15158, 1000=0,11660 (USD); ComponentLink1URL: https://datasheet.ciiva.com/22719/1737061-22719510.pdf?src-supplier=Element14; ComponentLink1Description: https://datasheet.ciiva.com/22719/1737061-22719510.pdf?src-supplier=Element14; ComponentLink2URL: https://datasheet.ciiva.com/7293/sn74lvc2g06-7293674.pdf?src-supplier=Newark; ComponentLink2Description: https://datasheet.ciiva.com/7293/sn74lvc2g06-7293674.pdf?src-supplier=Newark; ComponentLink3URL: https://datasheet.ciiva.com/46439/1786796-46439655.pdf?src-supplier=Element14; ComponentLink3Description: https://datasheet.ciiva.com/46439/1786796-46439655.pdf?src-supplier=Element14; ComponentLink4URL: https://datasheet.ciiva.com/1864/sn74lvc2g06-1864312.pdf?src-supplier=Digi-Key; ComponentLink4Description: https://datasheet.ciiva.com/1864/sn74lvc2g06-1864312.pdf?src-supplier=Digi-Key; ComponentLink5URL: https://datasheet.ciiva.com/1864/sn74lvc2g06-1864311.pdf?src-supplier=Digi-Key; ComponentLink5Description: https://datasheet.ciiva.com/1864/sn74lvc2g06-1864311.pdf?src-supplier=Digi-Key; ComponentLink6URL: https://datasheet.ciiva.com/1864/sn74lvc2g06-1864313.pdf?src-supplier=Digi-Key; ComponentLink6Description: https://datasheet.ciiva.com/1864/sn74lvc2g06-1864313.pdf?src-supplier=Digi-Key; ComponentLink7URL: https://datasheet.ciiva.com/14301/sn74lvc2g06-14301182.pdf?src-supplier=Avnet; ComponentLink7Description: https://datasheet.ciiva.com/14301/sn74lvc2g06-14301182.pdf?src-supplier=Avnet; ComponentLink8URL: https://datasheet.ciiva.com/26220/sn74lvc2g06-26220937.pdf?src-supplier=Avnet+Europe; ComponentLink8Description: https://datasheet.ciiva.com/26220/sn74lvc2g06-26220937.pdf?src-supplier=Avnet+Europe; Supplier Part Number 1: 296-13492-1-ND

## Sheet [7] SENSORS.SchDoc
size 431 x 279 mm; DocumentNumber: 8; SheetNumber: 8; SheetTotal: 9
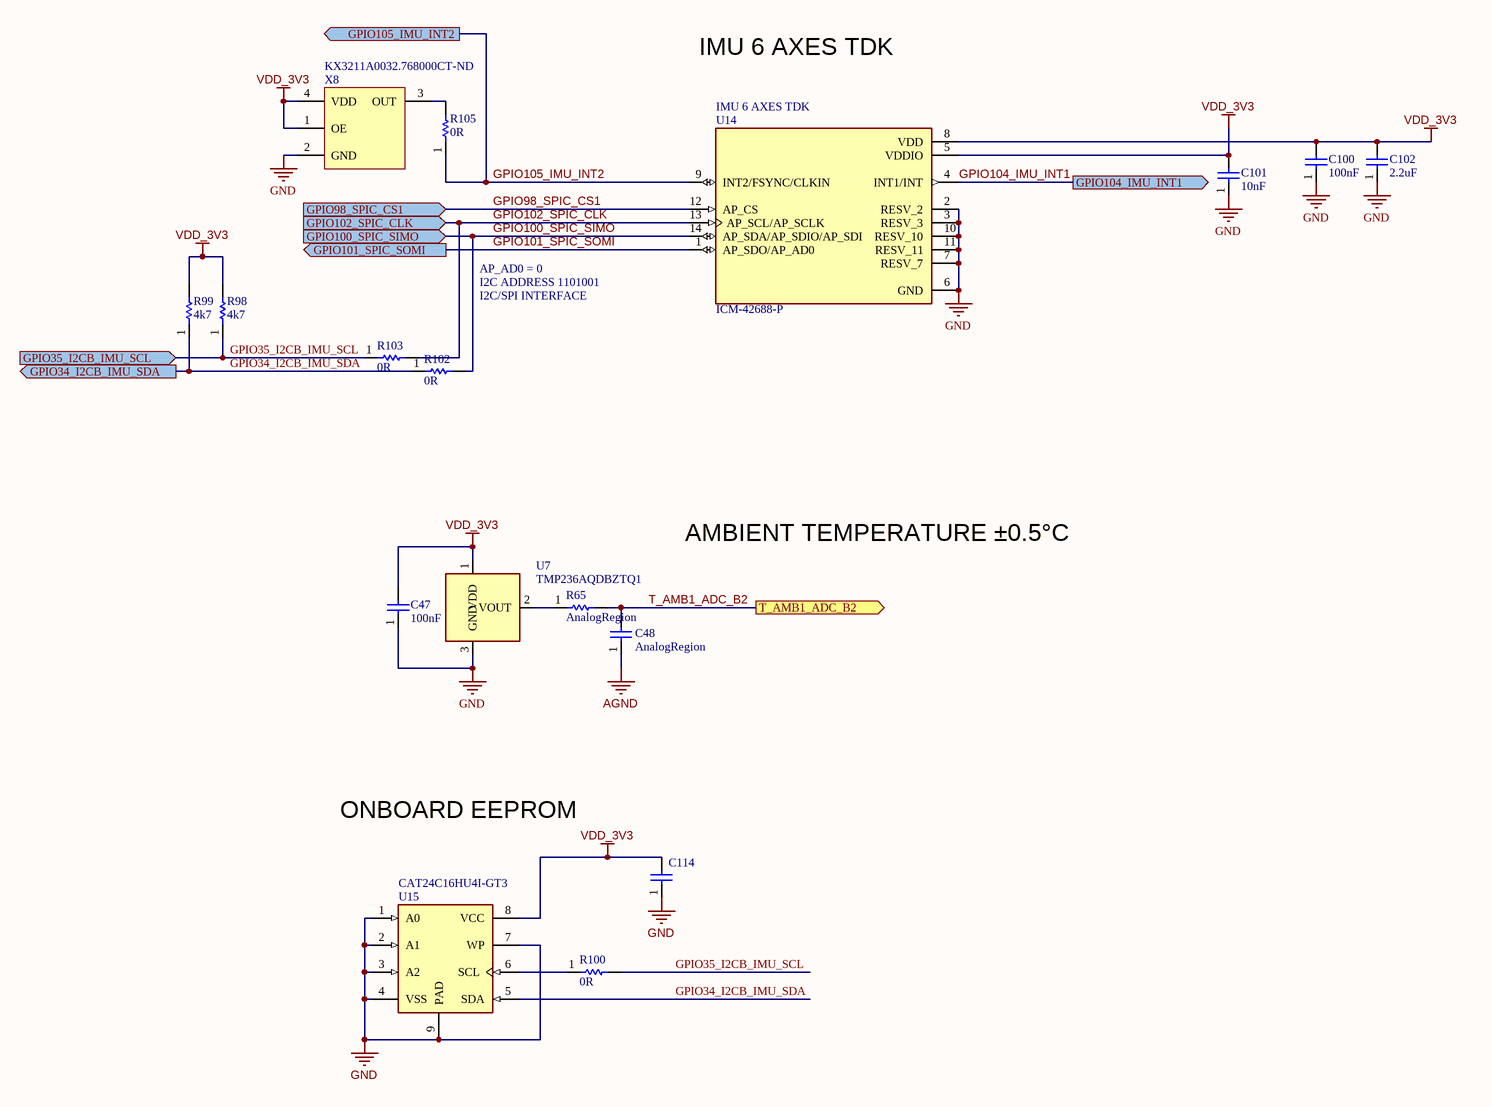
[diagram p7: [7] SENSORS.SchDoc]

### Parts
C47  value 100nF  [CAPC1005X03N(0402)]  (hidden comment: GRM155R71C104JA88D)
C48  ClassName: AnalogRegion  [CAPC1005X03N(0402)]  (hidden comment: GCM1555C1H471JA16D)
C100  value 100nF  [CAPC1005X03N(0402)]  (hidden comment: GRM155R71C104JA88D)
C101  value 10nF  [CAPC1005X03N(0402)]  (hidden comment: CC0402KRX7R9BB103)
C102  value 2.2uF  [CAPC1608X09N(0603)]  (hidden comment: GRM188R61A225KE34D)
C114  GRM155R71C104JA88D  [CAPC1005X03N(0402)]  (value not drawn)
R65  ClassName: AnalogRegion  [RESC1005X06N(0402)]  (hidden comment: CRCW0402220RFKED)
R98  value 4k7  [RESC1608X09N(0603)]  (hidden comment: CRCW06034K70FKEA)
R99  value 4k7  [RESC1608X09N(0603)]  (hidden comment: CRCW06034K70FKEA)
R100  value 0R  [RESC1608X09N(0603)]  (hidden comment: RC0603JR-070RL)
R102  value 0R  [0402]  (hidden comment: RCS04020000Z0ED)
R103  value 0R  [0402]  (hidden comment: RCS04020000Z0ED)
R105  value 0R  [0402]  (hidden comment: RCS04020000Z0ED)
U7  TMP236AQDBZTQ1  [SOT23]
U14  ICM-42688-P  [PQFN50P300X250X97-14N]
U15  CAT24C16HU4I-GT3  [UDFN8-EP]
X8  Supplier Part Number 1: KX3211A0032.768000CT-ND  [KX3211A0032.768000]  (hidden comment: 32.768Khz_OSC_KX3211A0032.768000)

### Ports
GPIO34_I2CB_IMU_SDA (out), GPIO35_I2CB_IMU_SCL (in), GPIO98_SPIC_CS1 (in), GPIO100_SPIC_SIMO (in), GPIO101_SPIC_SOMI (out), GPIO102_SPIC_CLK (in), GPIO104_IMU_INT1 (out), GPIO105_IMU_INT2 (out), T_AMB1_ADC_B2 (out)

### Nets
AGND: C48.1
GND: C47.1 C100.1 C101.1 C102.1 C114.1 U7.3(GND) U14.2(RESV_2) U14.3(RESV_3) U14.6(GND) U14.7(RESV_7) U14.10(RESV_10) U14.11(RESV_11) U15.1(A0) U15.2(A1) U15.3(A2) U15.4(VSS) U15.7(WP) U15.9(PAD) X8.2(GND)
VDD_3V3: C47.2 C100.2 C101.2 C102.2 C114.2 R98.2 R99.2 U7.1(VDD) U14.5(VDDIO) U14.8(VDD) U15.8(VCC) X8.1(OE) X8.4(VDD)
GPIO34_I2CB_IMU_SDA: R99.1 R102.1 U15.5(SDA) ; port GPIO34_I2CB_IMU_SDA
GPIO35_I2CB_IMU_SCL: R98.1 R100.2 R103.1 ; port GPIO35_I2CB_IMU_SCL
GPIO98_SPIC_CS1: U14.12(AP_CS) ; port GPIO98_SPIC_CS1
GPIO100_SPIC_SIMO: R102.2 U14.14(AP_SDA/AP_SDIO/AP_SDI) ; port GPIO100_SPIC_SIMO
GPIO101_SPIC_SOMI: U14.1(AP_SDO/AP_AD0) ; port GPIO101_SPIC_SOMI
GPIO102_SPIC_CLK: R103.2 U14.13(AP_SCL/AP_SCLK) ; port GPIO102_SPIC_CLK
GPIO104_IMU_INT1: U14.4(INT1/INT) ; port GPIO104_IMU_INT1
GPIO105_IMU_INT2: R105.1 U14.9(INT2/FSYNC/CLKIN) ; port GPIO105_IMU_INT2
T_AMB1_ADC_B2: C48.2 R65.2 ; port T_AMB1_ADC_B2
NetR65_1: R65.1 U7.2(VOUT)
NetR100_1: R100.1 U15.6(SCL)
NetR105_2: R105.2 X8.3(OUT)

### Notes on the sheet
- IMU 6 AXES TDK
- (near U14) IMU 6 AXES TDK
- AP_AD0 = 0
- I2C ADDRESS 1101001
- I2C/SPI INTERFACE
- AMBIENT TEMPERATURE ±0.5°C
- ONBOARD EEPROM
- REVISION
- DESCRIPTION
- DATE
- PROJECT:
- AUTHOR:
- TITLE:
- FILE NAME:
- CUR REV:
- PCB:
- SHEET:
- DATE:
- OF

### Library data of the parts
C47 C100 = 100nF_16V_0402_CAP: as C26-C33 on sheet [6] ETHERCAT; MPN: GRM155R71C104JA88D; Voltage Rating: 16V; Temp Coeff: X7R; Size/Package: 0402
C48 = 470pF_50V_0402_CAP: CAP CER 470PF 50V C0G/NP0 0402; Tolerance: 5%; Temp Coeff: C0G, NP0; Voltage: 50V; MPN: GCM1555C1H471JA16D; Size: 0402; Parameter 1: *
C101 = 10nF_50V_0402_CAP: as C62 on sheet [6] ETHERCAT; MPN: CC0402KRX7R9BB103; Voltage: 50V; Temp Coeff: X7R; Size/Package: 0402; Supplier 1: Digi-Key; Supplier Part Number 1: 311-1349-1-ND
C102 = 2.2uF_10V_0603_CAP: CAP CER 2.2UF 10V X5R 0603; Tolerance: 10%; MPN: GRM188R61A225KE34D; Voltage Rating: 10V; Temp Cofficient: X5R; Size: 0603; Supplier 1: Digikey; Supplier Part Number 1: 490-1545-1-ND
C114 = 100nF_16V_0402_CAP: as C40 on sheet [6] ETHERCAT; MPN: GRM155R71C104JA88D; Voltage Rating: 16V; Temp Coeff: X7R; Size/Package: 0402
R65 = 220_1/16W_0402_RES: RES SMD 220 OHM 1% 1/16W 0402; Tolerance: 1%.; Supplier 1: Digikey; Supplier Part Number 1: 541-220LCT-ND; MPN: CRCW0402220RFKED; Package: 0402; Wattage: 1/16W; Parameter 1: *
R98 R99 = 4k7_1/10W_0603_RES: RES SMD 4.7K OHM 1% 1/10W 0603; Wattage: 0.1W; MPN: CRCW06034K70FKEA; Drawn By: TC; Check By: *; Tolarance: 1%; Supplier 1: Digi-Key; Supplier Part Number 1: 541-4.70KHCT-ND
R100 = 0R_1/10W_0603_RES: RES SMD 0 OHM JUMPER 1/10W 0603; MPN: RC0603JR-070RL; Tolerance: Jumper; Power: 1/10W; Package/Case: 0603; Supplier 1: Digi-Key; Supplier Part Number 1: 311-0.0GRDKR-ND
R102 R103 R105 = 0R_1/5W_0402_RCS04020000Z0ED_RES: VISHAY - RCS04020000Z0ED - SMD Chip Resistor, 0402 [1005 Metric], 0 ohm, RCS Series, 50 V, Thick Film, 200 mW; Manufacturer: Vishay Dale; Resistance: 0mR; Max Power Dissipation: 200mW; Supplier 1: Digi-Key; Manufacturer Part Number: RCS04020000Z0ED; RoHS: Yes; Category: Chip SMD Resistors; Stock 1: 18214; Pricing 1: 1=0.10000, 10=0.08300, 25=0.05760, 50=0.04480, 100=0.03200, 250=0.02496, 500=0.01984, 1000=0.01408, 5000=0.01088 (USD); Case/Package: 0402; Case Code (Metric): 1005; Case Code (Imperial): 0402; Min Operating Temperature: -55°C; Max Operating Temperature: 155°C; Packaging: Tape and Reel; Resistor Type: Thick Film; Number of Terminations: 2; Features: Automotive AEC-Q200; Length: 0.039inch; Width: 0.02inch; Height: 0.016inch; RoHS Compliant: Yes; ComponentLink1URL: http://www.farnell.com/datasheets/2618474.pdf?src-supplier=Farnell; ComponentLink1Description: http://www.farnell.com/datasheets/2618474.pdf?src-supplier=Farnell; ComponentLink2URL: http://www.vishay.com/docs/20065/rcse3.pdf?src-supplier=Digi-Key; ComponentLink2Description: http://www.vishay.com/docs/20065/rcse3.pdf?src-supplier=Digi-Key; ComponentLink3URL: http://www.farnell.com/datasheets/2618474.pdf?src-supplier=Element14; ComponentLink3Description: http://www.farnell.com/datasheets/2618474.pdf?src-supplier=Element14; ComponentLink4URL: http://www.farnell.com/datasheets/2618474.pdf?src-supplier=Newark; ComponentLink4Description: http://www.farnell.com/datasheets/2618474.pdf?src-supplier=Newark; Supplier Part Number 1: 541-2877-1-ND
U7 = TMP236AQDBZTQ1_TEMP_SENSOR: TMP23x-Q1 Automotive Grade, High-Accuracy Analog Output Temperature Sensors; Manufacturer: Texas Instruments; Supplier 1: Digi-Key; Manufacturer Part Number: TMP236AQDBZTQ1; RoHS: Yes; Category: Integrated Circuits (ICs); Pricing 1: 1=0.91000, 5=0.86800, 10=0.75500, 25=0.66320, 50=0.55080, 100=0.46920 (USD); Supplier Part Number 1: 296-TMP236AQDBZTQ1DKR-ND
U14 = ICM-42688-P_IMU_6-axes: Accelerometer and Gyroscope 6-Axis MEMS Motion Tracking Device Digital-OUT 14-Pin LGA T/R; Manufacturer: TDK InvenSense; Supplier 1: Digi-Key; Manufacturer Part Number: ICM-42688-P; RoHS: Yes; Category: Inertial Measurement Units (IMUs); Pricing 1: 1=7,96000, 5=7,02000, 10=6,20100, 25=5,03120, 50=4,44600, 100=4,32900, 500=3,62700, 1000=3,39300 (USD); Supplier Part Number 1: 1428-ICM-42688-PCT-ND
U15 = CAT24C16HU4I-GT3_EEPROM_16Kb: as U4 on sheet [6] ETHERCAT; Supplier 1: Digi-Key; Manufacturer Part Number: CAT24C16HU4I-GT3; RoHS: Yes; Category: EEPROM; Stock 1: 2625; Pricing 1: 1=0.41000, 10=0.40300, 25=0.37440, 50=0.37240, 100=0.33080, 250=0.32656, 500=0.32164, 1000=0.31304 (USD); Mount: Surface Mount; Number of Pins: 8; Contact Plating: Gold; Min Operating Temperature: -40°C; Max Operating Temperature: 85°C; Packaging: Tape and Reel; Memory Type: EEPROM; Package Quantity: 3000; Memory Size: 16Kb; Series: -; Access Time-Max: 900ns; Supply Current: 2mA; Length: 3.05mm; Width: 2.05mm; Height: 0.5mm; REACH SVHC: No SVHC; Lead Free: Lead Free; Halogen Free: Halogen Free; RoHS Compliant: Yes; ComponentLink1URL: https://datasheet.ciiva.com/22618/1696759-22618473.pdf?src-supplier=Element14; ComponentLink1Description: https://datasheet.ciiva.com/22618/1696759-22618473.pdf?src-supplier=Element14; Supplier Part Number 1: CAT24C16HU4I-GT3OSCT-ND
X8 = 32.768Khz_OSC_KX3211A0032.768000: SMD Crystal Oscillator 0.032768MHz 3.3V 15pF 4-Pin CSMD; Manufacturer: Diodes; Max Supply Current: 15uA; Frequency Stability: 20ppm; Supplier 1: Digi-Key; Manufacturer Part Number: KX3211A0032.768000; RoHS: Yes; Category: Oscillators; Stock 1: 5092; Pricing 1: 1=2.26000, 10=2.20500, 50=2.10000, 100=1.83750, 500=1.78500, 1000=1.52250 (USD); Mount: Surface Mount; Case/Package: SMD/SMT; Min Operating Temperature: -20°C; Max Operating Temperature: 70°C; Package Quantity: 100; Frequency: 32.768kHz; Packaging: Cut Strip; Length: 0.126inch; Width: 0.098inch; Height: 0.045inch; RoHS Compliant: Yes; ComponentLink1URL: https://www.diodes.com/assets/Datasheets/KX321.pdf?src-supplier=Digi-Key; ComponentLink1Description: https://www.diodes.com/assets/Datasheets/KX321.pdf?src-supplier=Digi-Key; ComponentLink2URL: https://www.pericom.com/assets/Datasheets/KX321.pdf?src-supplier=Digi-Key; ComponentLink2Description: https://www.pericom.com/assets/Datasheets/KX321.pdf?src-supplier=Digi-Key